# EAGLE schematic ZDR5V (EAGLE 7.5.0)
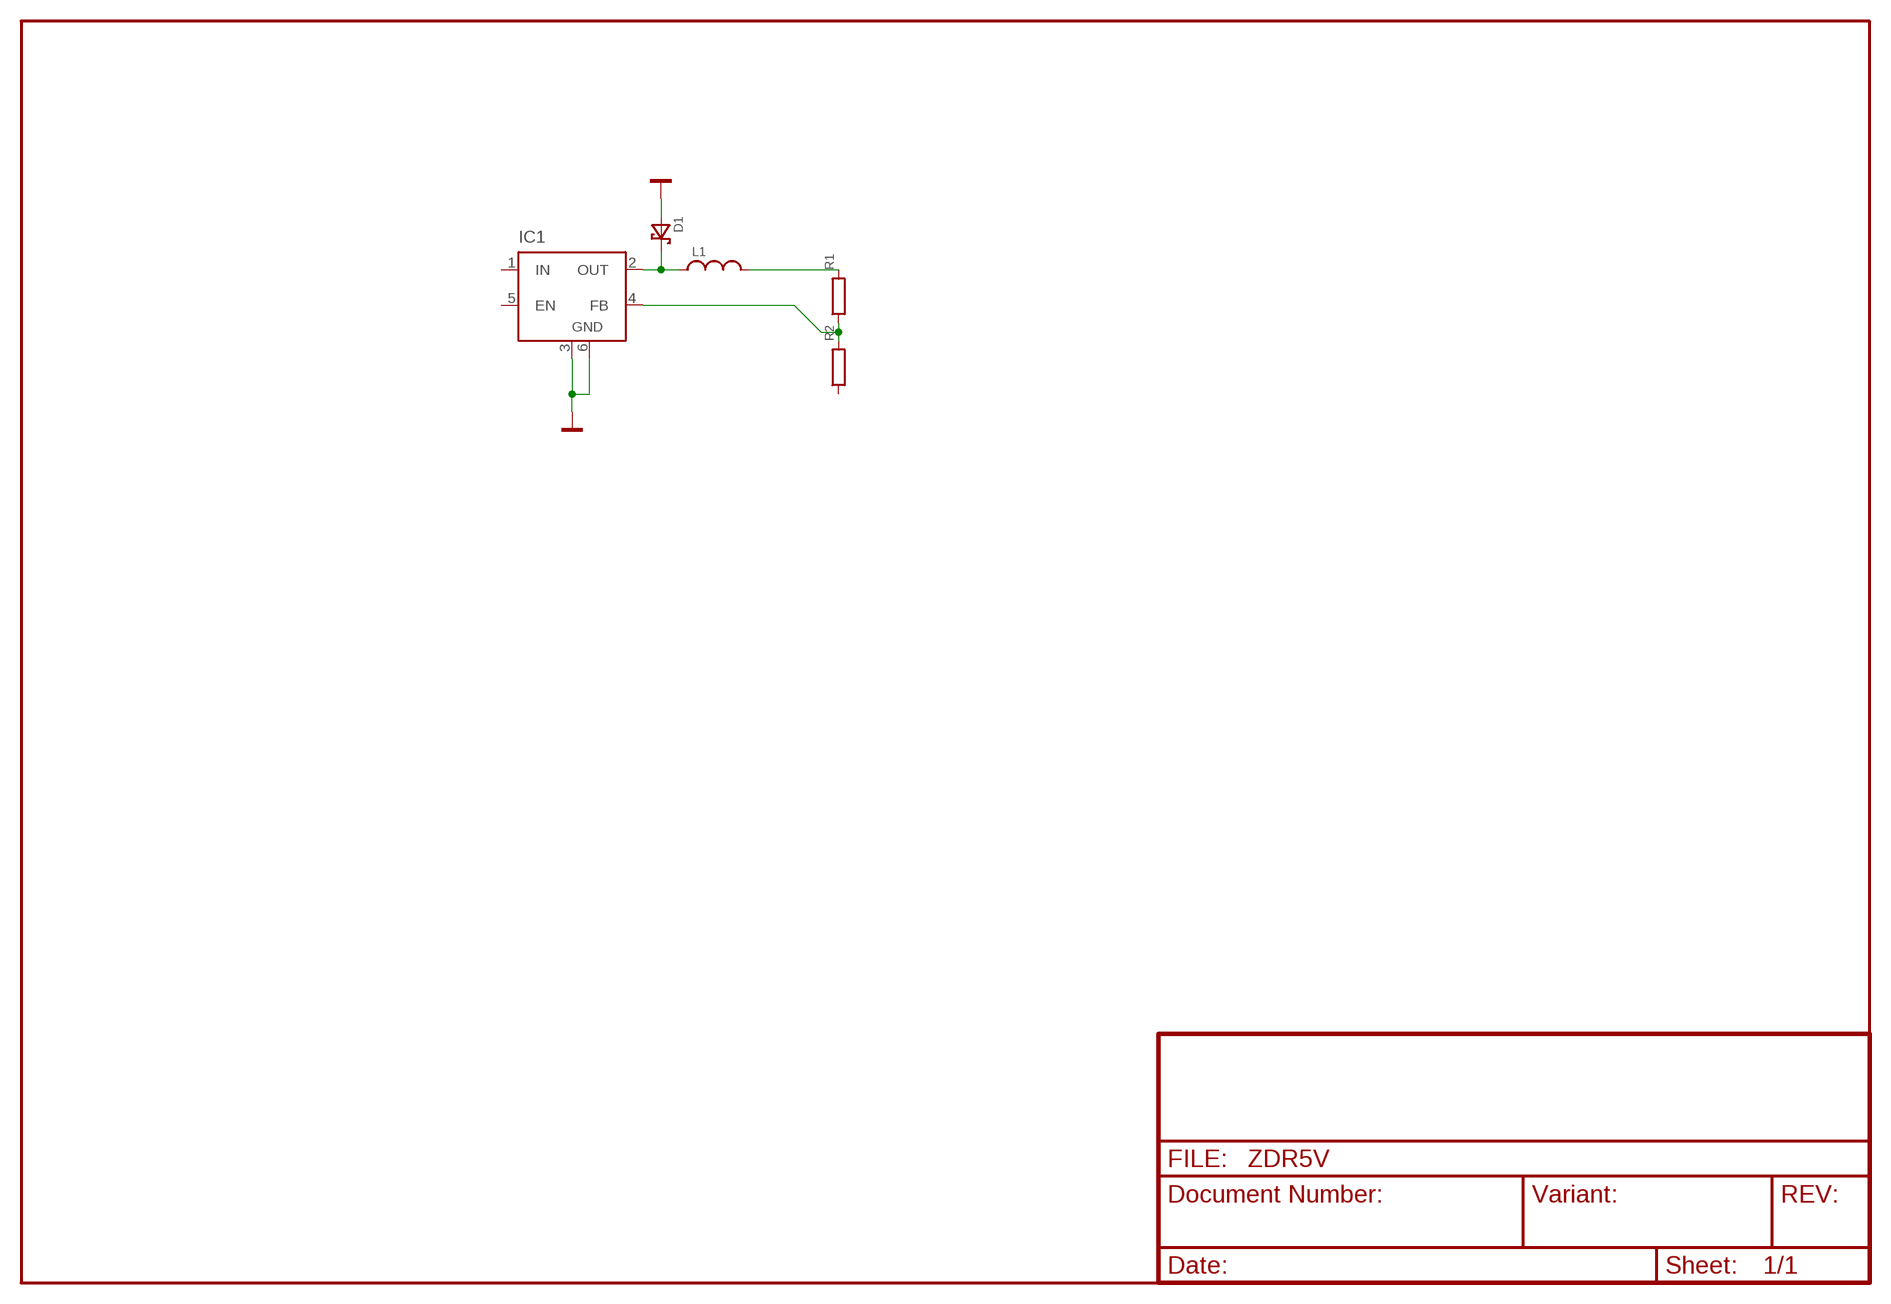
[diagram p0: schematic, sheet 1]

## Parts
D1  D_SCHOTKY_SMB  [D_SMB]
IC1  LM2596S  [TO263-5]
L1  L_DE1209  [DE1209]
R1  R_R0805  [0805]
R2  R_R0805  [0805]

## Nets
GND: D1.A IC1.3(GND) IC1.6(GND)
N$2: D1.K IC1.2(OUT) L1.2
N$3: L1.1 R1.2
N$4: IC1.4(FB) R1.1 R2.2
Unconnected: IC1.1(IN) IC1.5(EN) R2.1

## Library data of the parts
D1 = !discrete:D_SCHOTKY: Dioda Schottkyho Typ Ur (Urpk] Uf I (Ipk] Pouzdro SD103B 30 V 200 mA DO35 BAT42 30 V 200 mA DO35 BAT43 30 V 200 mA DO35 BAT46 100 V 150 mA DO35 BAT47 20 V 350 mA DO35 BAT48 40 V 350 mA DO35 SK24 40 V (28V) 0.55V 2A (50A) DO214AA (SMB) SK26 60 V 0.65V 2A (50A) DO214AA (SMB)
IC1 = linear:LM2596S: STEP-DOWN VOLTAGE REGULATOR
L1 = !discrete:L: Indukcnost
R1 R2 = !discrete:R_: Rezistor